# Altium schematic sheet dht11.SchDoc
size A4; SheetNumber: 2; SheetTotal: 6
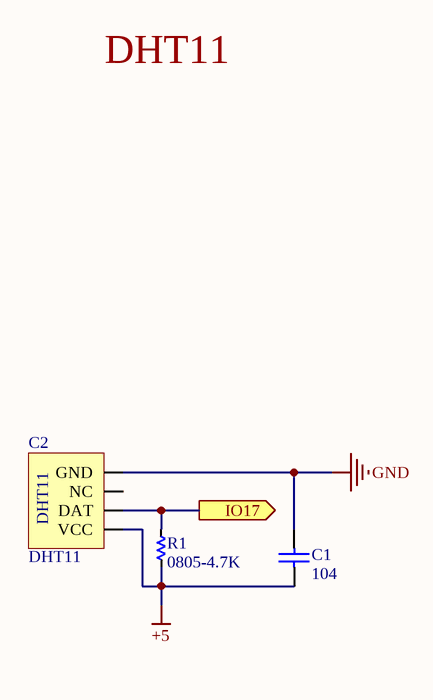
[diagram p0: dht11.SchDoc]

## Parts
C1  104  [0805]
C2  DHT11  [DHT11]
R1  0805-4.7K  [RES-SMD-0805]

## Ports
IO17 (out)

## Nets
+5: C1.1 C2.1(VCC) R1.2
GND: C1.2 C2.4(GND)
IO17: C2.2(DAT) R1.1 ; port IO17

Not connected (* = marked no-connect by the designer): C2 3(NC)

## Notes on the sheet
- DHT11

## Library data of the parts
C1 = Cap 104_SMD: Capacitor (Semiconductor SIM Model); Value: 0.1uF; Published: 8-Jun-2000; LatestRevisionDate: 17-Jul-2002; LatestRevisionNote: Re-released for DXP Platform.; PackageReference: C1206; Publisher: Altium Limited
C2 = DHT11: Manufacturer: W¨¹rth Elektronik eiSos GmbH; partNo: 613004143121; ComponentLink1 Description: Manufacturer; ComponentLink2 Description: Datasheet; NoPins: 04; Created Date: 29 March 2013; ComponentLink1URL: http://www.we-online.com; ComponentLink2URL: http://katalog.we-online.de/em/datasheet/6130xx143121.pdf; Created by: Karrer Zheng
R1 = Res-SMD: Resistor; Manufacturer: Generic Components; Class: Passive; Published: 08/06/2000; Publisher: Altium Hobart Technology Centre